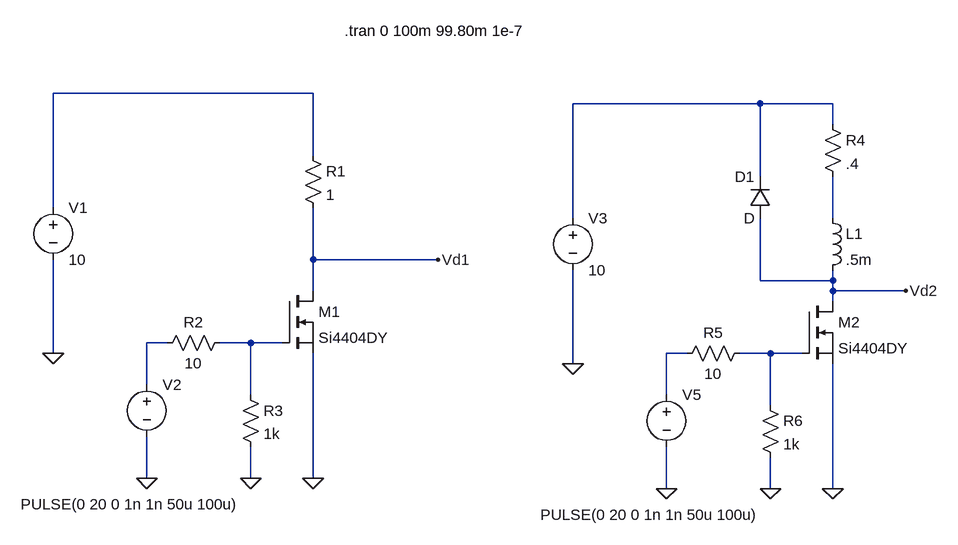
[diagram p0: schematic 07-switchingLosses.asc]
07-switchingLosses.asc, the LTspice schematic file:
Version 4
SHEET 1 1440 680
WIRE 464 -48 64 -48
WIRE 1152 -32 864 -32
WIRE 1264 -32 1152 -32
WIRE 1264 0 1264 -32
WIRE 464 48 464 -48
WIRE 1152 80 1152 -32
WIRE 64 128 64 -48
WIRE 864 144 864 -32
WIRE 1264 144 1264 80
WIRE 464 208 464 128
WIRE 656 208 464 208
WIRE 1152 240 1152 144
WIRE 1264 240 1264 224
WIRE 1264 240 1152 240
WIRE 464 256 464 208
WIRE 1264 256 1264 240
WIRE 1376 256 1264 256
WIRE 1264 272 1264 256
WIRE 240 336 208 336
WIRE 368 336 320 336
WIRE 416 336 368 336
WIRE 64 352 64 208
WIRE 1040 352 1008 352
WIRE 1168 352 1120 352
WIRE 1216 352 1168 352
WIRE 864 368 864 224
WIRE 208 400 208 336
WIRE 368 416 368 336
WIRE 1008 416 1008 352
WIRE 1168 432 1168 352
WIRE 208 544 208 480
WIRE 368 544 368 496
WIRE 464 544 464 352
WIRE 1008 560 1008 496
WIRE 1168 560 1168 512
WIRE 1264 560 1264 368
FLAG 464 544 0
FLAG 208 544 0
FLAG 64 352 0
FLAG 368 544 0
FLAG 1264 560 0
FLAG 1008 560 0
FLAG 864 368 0
FLAG 1168 560 0
FLAG 656 208 Vd1
FLAG 1376 256 Vd2
SYMBOL voltage 64 112 R0
WINDOW 123 0 0 Left 0
WINDOW 39 0 0 Left 0
SYMATTR InstName V1
SYMATTR Value 10
SYMBOL res 448 32 R0
SYMATTR InstName R1
SYMATTR Value 1
SYMBOL voltage 208 384 R0
WINDOW 3 -194 200 Left 2
WINDOW 123 0 0 Left 0
WINDOW 39 0 0 Left 0
SYMATTR InstName V2
SYMATTR Value PULSE(0 20 0 1n 1n 50u 100u)
SYMBOL res 336 320 R90
WINDOW 0 0 56 VBottom 2
WINDOW 3 32 56 VTop 2
SYMATTR InstName R2
SYMATTR Value 10
SYMBOL nmos 416 256 R0
SYMATTR InstName M1
SYMATTR Value Si4404DY
SYMBOL res 352 400 R0
SYMATTR InstName R3
SYMATTR Value 1k
SYMBOL voltage 864 128 R0
WINDOW 123 0 0 Left 0
WINDOW 39 0 0 Left 0
SYMATTR InstName V3
SYMATTR Value 10
SYMBOL res 1248 -16 R0
SYMATTR InstName R4
SYMATTR Value .4
SYMBOL res 1136 336 R90
WINDOW 0 0 56 VBottom 2
WINDOW 3 32 56 VTop 2
SYMATTR InstName R5
SYMATTR Value 10
SYMBOL nmos 1216 272 R0
SYMATTR InstName M2
SYMATTR Value Si4404DY
SYMBOL res 1152 416 R0
SYMATTR InstName R6
SYMATTR Value 1k
SYMBOL diode 1168 144 R180
WINDOW 0 24 64 Left 2
WINDOW 3 24 0 Left 2
SYMATTR InstName D1
SYMBOL ind 1248 128 R0
SYMATTR InstName L1
SYMATTR Value .5m
SYMBOL voltage 1008 400 R0
WINDOW 3 -194 200 Left 2
WINDOW 123 0 0 Left 0
WINDOW 39 0 0 Left 0
SYMATTR InstName V5
SYMATTR Value PULSE(0 20 0 1n 1n 50u 100u)
TEXT 512 -144 Left 2 !.tran 0 100m 99.80m 1e-7

The netlist it stands for:
* 07-switchingLosses.asc
V1 N001 0 10
R1 N001 Vd1 1
V2 N004 0 PULSE(0 20 0 1n 1n 50u 100u)
R2 N005 N004 10
M1 Vd1 N005 0 0 Si4404DY
R3 N005 0 1k
V3 N002 0 10
R4 N002 N003 .4
R5 N007 N006 10
M2 Vd2 N007 0 0 Si4404DY
R6 N007 0 1k
D1 Vd2 N002 D
L1 N003 Vd2 .5m
V5 N006 0 PULSE(0 20 0 1n 1n 50u 100u)
.model D D
.lib standard.dio
.model NMOS NMOS
.model PMOS PMOS
.lib standard.mos
.tran 0 100m 99.80m 1e-7
.backanno
.end